# Altium schematic sheet PCIe x4.SchDoc
size 594 x 420 mm
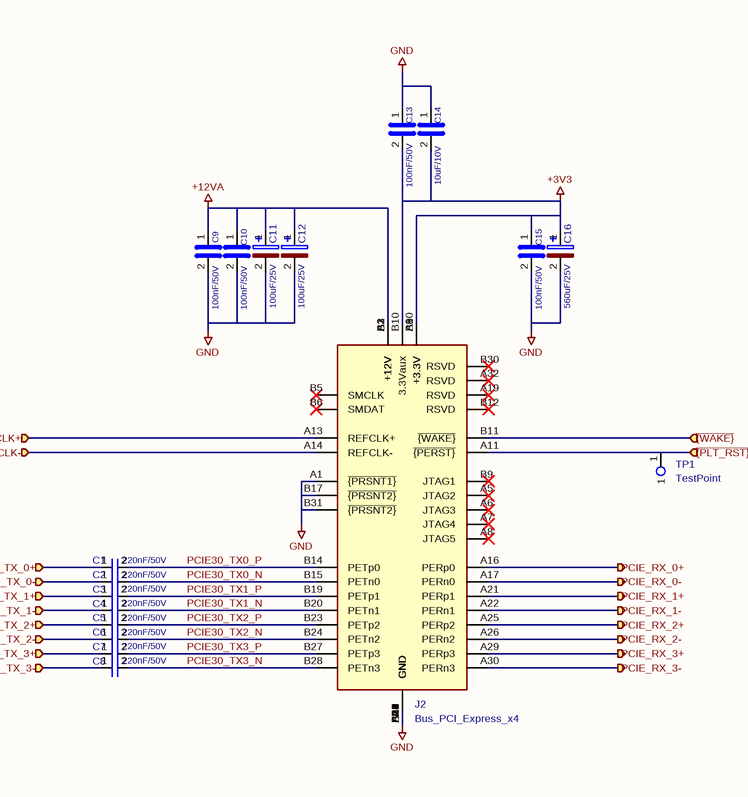
[diagram p0: PCIe x4.SchDoc]

## Parts
C1  220nF/50V  [C_0402_1005Metric]
C2  220nF/50V  [C_0402_1005Metric]
C3  220nF/50V  [C_0402_1005Metric]
C4  220nF/50V  [C_0402_1005Metric]
C5  220nF/50V  [C_0402_1005Metric]
C6  220nF/50V  [C_0402_1005Metric]
C7  220nF/50V  [C_0402_1005Metric]
C8  220nF/50V  [C_0402_1005Metric]
C9  100nF/50V  [C_0402_1005Metric]
C10  100nF/50V  [C_0402_1005Metric]
C11  100uF/25V  [CP_Elec_6.3x7.7]
C12  100uF/25V  [CP_Elec_6.3x7.7]
C13  100nF/50V  [C_0402_1005Metric]
C14  10uF/10V  [C_0402_1005Metric]
C15  100nF/50V  [C_0402_1005Metric]
C16  560uF/25V  [CP_Elec_6.3x7.7]
J2  Bus_PCI_Express_x4  [PCIe_x4_Gen3Slot_Connectors]
TP1  TestPoint  [TestPoint_Pad_D1.5mm]

## Ports
PCIE_RX_0+ (out), PCIE_RX_0- (out), PCIE_RX_1+ (out), PCIE_RX_1- (out), PCIE_RX_2+ (out), PCIE_RX_2- (out), PCIE_RX_3+ (out), PCIE_RX_3- (out), PCIE_TX_0+ (in), PCIE_TX_0- (in), PCIE_TX_1+ (in), PCIE_TX_1- (in), PCIE_TX_2+ (in), PCIE_TX_2- (in), PCIE_TX_3+ (in), PCIE_TX_3- (in), REFCLK+ (in), REFCLK- (in), ~{{PLT_RST}} (in), ~{{WAKE}} (in)

## Nets
+3V3: C13.2 C14.2 C15.1 C16.1 J2.A9(+3.3V) J2.A10(+3.3V) J2.B8(+3.3V) J2.B10(3.3Vaux)
+12VA: C9.1 C10.1 C11.1 C12.1 J2.A2(+12V) J2.A3(+12V) J2.B1(+12V) J2.B2(+12V) J2.B3(+12V)
GND: C9.2 C10.2 C11.2 C12.2 C13.1 C14.1 C15.2 C16.2 J2.A1(~{{PRSNT1}}) J2.A4(GND) J2.A12(GND) J2.A15(GND) J2.A18(GND) J2.A20(GND) J2.A23(GND) J2.A24(GND) J2.A27(GND) J2.A28(GND) J2.A31(GND) J2.B4(GND) J2.B7(GND) J2.B13(GND) J2.B16(GND) J2.B17(~{{PRSNT2}}) J2.B18(GND) J2.B21(GND) J2.B22(GND) J2.B25(GND) J2.B26(GND) J2.B29(GND) J2.B31(~{{PRSNT2}}) J2.B32(GND)
PCIE30_TX0_N: C2.2 J2.B15(PETn0)
PCIE30_TX0_P: C1.2 J2.B14(PETp0)
PCIE30_TX1_N: C4.2 J2.B20(PETn1)
PCIE30_TX1_P: C3.2 J2.B19(PETp1)
PCIE30_TX2_N: C6.2 J2.B24(PETn2)
PCIE30_TX2_P: C5.2 J2.B23(PETp2)
PCIE30_TX3_N: C8.2 J2.B28(PETn3)
PCIE30_TX3_P: C7.2 J2.B27(PETp3)
PCIE_RX_0+: J2.A16(PERp0) ; port PCIE_RX_0+
PCIE_RX_0-: J2.A17(PERn0) ; port PCIE_RX_0-
PCIE_RX_1+: J2.A21(PERp1) ; port PCIE_RX_1+
PCIE_RX_1-: J2.A22(PERn1) ; port PCIE_RX_1-
PCIE_RX_2+: J2.A25(PERp2) ; port PCIE_RX_2+
PCIE_RX_2-: J2.A26(PERn2) ; port PCIE_RX_2-
PCIE_RX_3+: J2.A29(PERp3) ; port PCIE_RX_3+
PCIE_RX_3-: J2.A30(PERn3) ; port PCIE_RX_3-
PCIE_TX_0+: C1.1 ; port PCIE_TX_0+
PCIE_TX_0-: C2.1 ; port PCIE_TX_0-
PCIE_TX_1+: C3.1 ; port PCIE_TX_1+
PCIE_TX_1-: C4.1 ; port PCIE_TX_1-
PCIE_TX_2+: C5.1 ; port PCIE_TX_2+
PCIE_TX_2-: C6.1 ; port PCIE_TX_2-
PCIE_TX_3+: C7.1 ; port PCIE_TX_3+
PCIE_TX_3-: C8.1 ; port PCIE_TX_3-
REFCLK+: J2.A13(REFCLK+) ; port REFCLK+
REFCLK-: J2.A14(REFCLK-) ; port REFCLK-
~{{PLT_RST}}: J2.A11(~{{PERST}}) TP1.1 ; port ~{{PLT_RST}}
~{{WAKE}}: J2.B11(~{{WAKE}}) ; port ~{{WAKE}}

Not connected (* = marked no-connect by the designer): J2 A5(JTAG2)* A6(JTAG3)* A7(JTAG4)* A8(JTAG5)* A19(RSVD)* A32(RSVD)* B5(SMCLK)* B6(SMDAT)* B9(JTAG1)* B12(RSVD)* B30(RSVD)*

## Notes on the sheet
- 1
- 2
- 3
- 4
- 5
- 6
- 7
- 8
- 9
- 10
- 11
- A
- B
- C
- D
- E
- F
- G
- H
- Title: Primer Carrier for LattePanda Mu
- File: PCIe x4.kicad_sch
- Sheet: /
- DFRobot
- KiCad E.D.A.  kicad (5.1.4)-1
- Size: A2
- Date: 2024-03-13
- Rev: V1.0.0
- Id: 1/1

## Library data of the parts
C1-C8 = C_Small: SCH_Show_Footprint: C0402; Value: 220nF/50V; Footprint: A_HDJ_Library:C_0402_1005Metric
C9 C10 C13-C15 = C: SCH_Show_Footprint: C0402; Footprint: A_HDJ_Library:C_0402_1005Metric
  C9 C10 C13 C15: Value: 100nF/50V
  C14: Value: 10uF/10V
C11 C12 C16 = C_Polarized: SCH_Show_Footprint: C5x5.8; Footprint: A_HDJ_Library:CP_Elec_6.3x7.7
  C11 C12: Value: 100uF/25V
  C16: Value: 560uF/25V
J2 = Bus_PCI_Express_x4: Value: Bus_PCI_Express_x4; Footprint: A_HDJ_Library:PCIe_x4_Gen3Slot_Connectors
TP1 = TestPoint: Value: TestPoint; Footprint: A_HDJ_Library:TestPoint_Pad_D1.5mm